# Altium schematic sheet Review.SchDoc: AC Dimmer Controller
size A4; DocumentNumber: 1; SheetNumber: 1; SheetTotal: 10
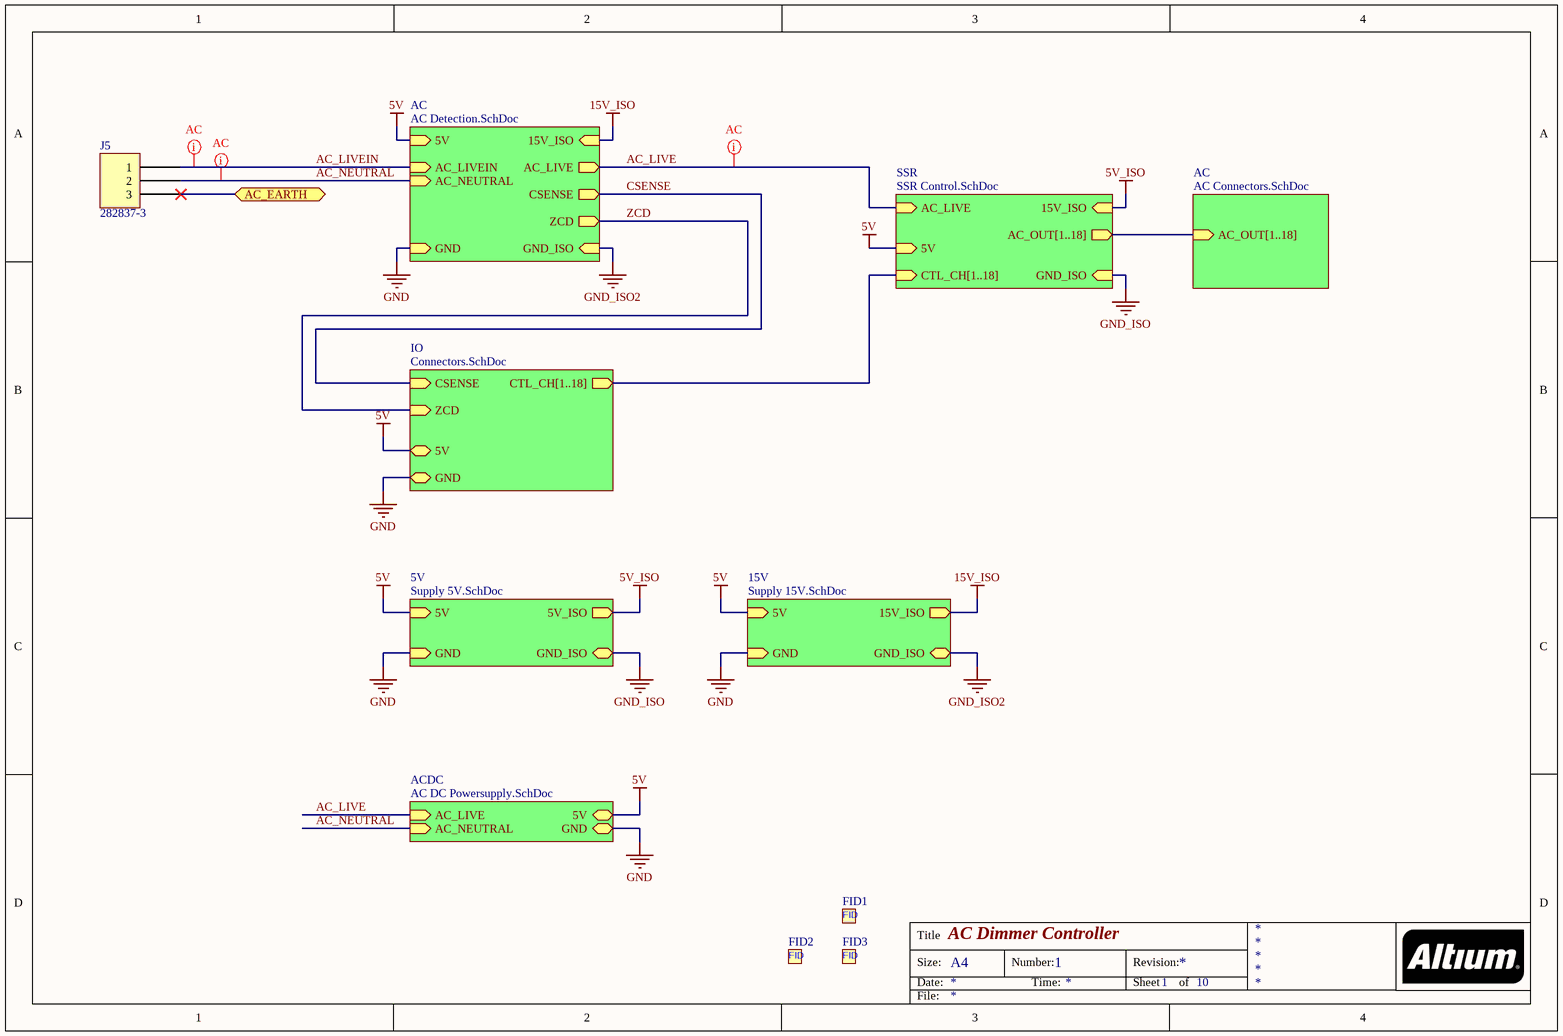
[diagram p0: Review.SchDoc]

## Parts
FID1  Fiducial  [Fiducial-1mm]  (value not drawn)  (no BOM)
FID2  Fiducial  [Fiducial-1mm]  (value not drawn)  (no BOM)
FID3  Fiducial  [Fiducial-1mm]  (value not drawn)  (no BOM)
J5  282837-3  [TE 282837-3]

## Sub-sheets
5V = Supply 5V.SchDoc: GND (in), 5V (in), 5V_ISO (out), GND_ISO (bidir)
15V = Supply 15V.SchDoc: GND_ISO (bidir), 15V_ISO (out), 5V (in), GND (in)
AC = AC Detection.SchDoc: CSENSE (out), AC_LIVE (out), AC_LIVEIN (in), AC_NEUTRAL (in), ZCD (out), 15V_ISO (in), GND_ISO (in), GND (in), 5V (in)
AC = AC Connectors.SchDoc: AC_OUT[1..18] (in)
ACDC = AC DC Powersupply.SchDoc: AC_LIVE (in), AC_NEUTRAL (in), GND (bidir), 5V (bidir)
IO = Connectors.SchDoc: ZCD (in), CSENSE (in), CTL_CH[1..18] (out), 5V (bidir), GND (bidir)
SSR = SSR Control.SchDoc: CTL_CH[1..18] (in), AC_OUT[1..18] (out), AC_LIVE (in), 5V (in), 15V_ISO (in), GND_ISO (in)

## Ports
AC_EARTH (bidir)

## Nets
5V: sheet AC/5V, sheet 5V/5V, sheet 15V/5V, sheet SSR/5V, sheet IO/5V, sheet ACDC/5V
5V_ISO: sheet 5V/5V_ISO, sheet SSR/15V_ISO
15V_ISO: sheet AC/15V_ISO, sheet 15V/15V_ISO
GND: sheet AC/GND, sheet 5V/GND, sheet 15V/GND, sheet IO/GND, sheet ACDC/GND
GND_ISO: sheet 5V/GND_ISO, sheet SSR/GND_ISO
GND_ISO2: sheet AC/GND_ISO, sheet 15V/GND_ISO
AC_EARTH: J5.3 ; port AC_EARTH
AC_LIVE: sheet AC/AC_LIVE, sheet SSR/AC_LIVE, sheet ACDC/AC_LIVE
AC_LIVEIN: J5.1 ; sheet AC/AC_LIVEIN
AC_NEUTRAL: J5.2 ; sheet AC/AC_NEUTRAL, sheet ACDC/AC_NEUTRAL
CSENSE: sheet AC/CSENSE, sheet IO/CSENSE
ZCD: sheet AC/ZCD, sheet IO/ZCD

## Buses and harness runs
bus sheet AC/AC_OUT[1..18] = sheet SSR/AC_OUT[1..18]
bus sheet IO/CTL_CH[1..18] = sheet SSR/CTL_CH[1..18]

## Layout directives
net class AC: AC_LIVE, AC_LIVEIN, AC_NEUTRAL

## Notes on the sheet
- Title
- Size:
- Date:
- A4
- Number:
- Time:
- Revision:
- Sheet
- of
- File:
- (in symbol Fiducial) FID

## Library data of the parts
J5 = 282837-3: TERM BLK 3P SIDE ENT 5.08MM PCB; Manufacturer: TE Connectivity AMP Connectors; Current: 13.5 A; Mating Orientation: Horizontal with Board; Number of Levels: 1; Pitch: 0.200" (5.08mm); Positions Per Level: 3; Voltage: 300 V; Wire Gauge: 16-28 AWG; Wire Termination: Screw - Rising Cage Clamp; Part Number: 282837-3; Color: Green; ComponentLink1Description: Datasheet; ComponentLink1URL: https://www.te.com/commerce/DocumentDelivery/DDEController?Action=srchrtrv&DocNm=282837&DocType=Customer+Drawing&DocLang=English; ComponentLink2Description: DigiKey Link; ComponentLink2URL: https://www.digikey.com/en/products/detail/te-connectivity-amp-connectors/282837-3/2187974; Features: Interlocking (Side); LastUpdated: 6/21/2022 3:00:39 PM; Lifecycle Status: Active; Minimum Order: 1; Mounting Type: Through Hole; Packaging: Tray; Part Status: Active; Price: 0.47; Series: Buchanan; Supplier 1: DigiKey; Supplier Part Number 1: A113321-ND